# Altium schematic sheet t1-power3.SchDoc
size A3
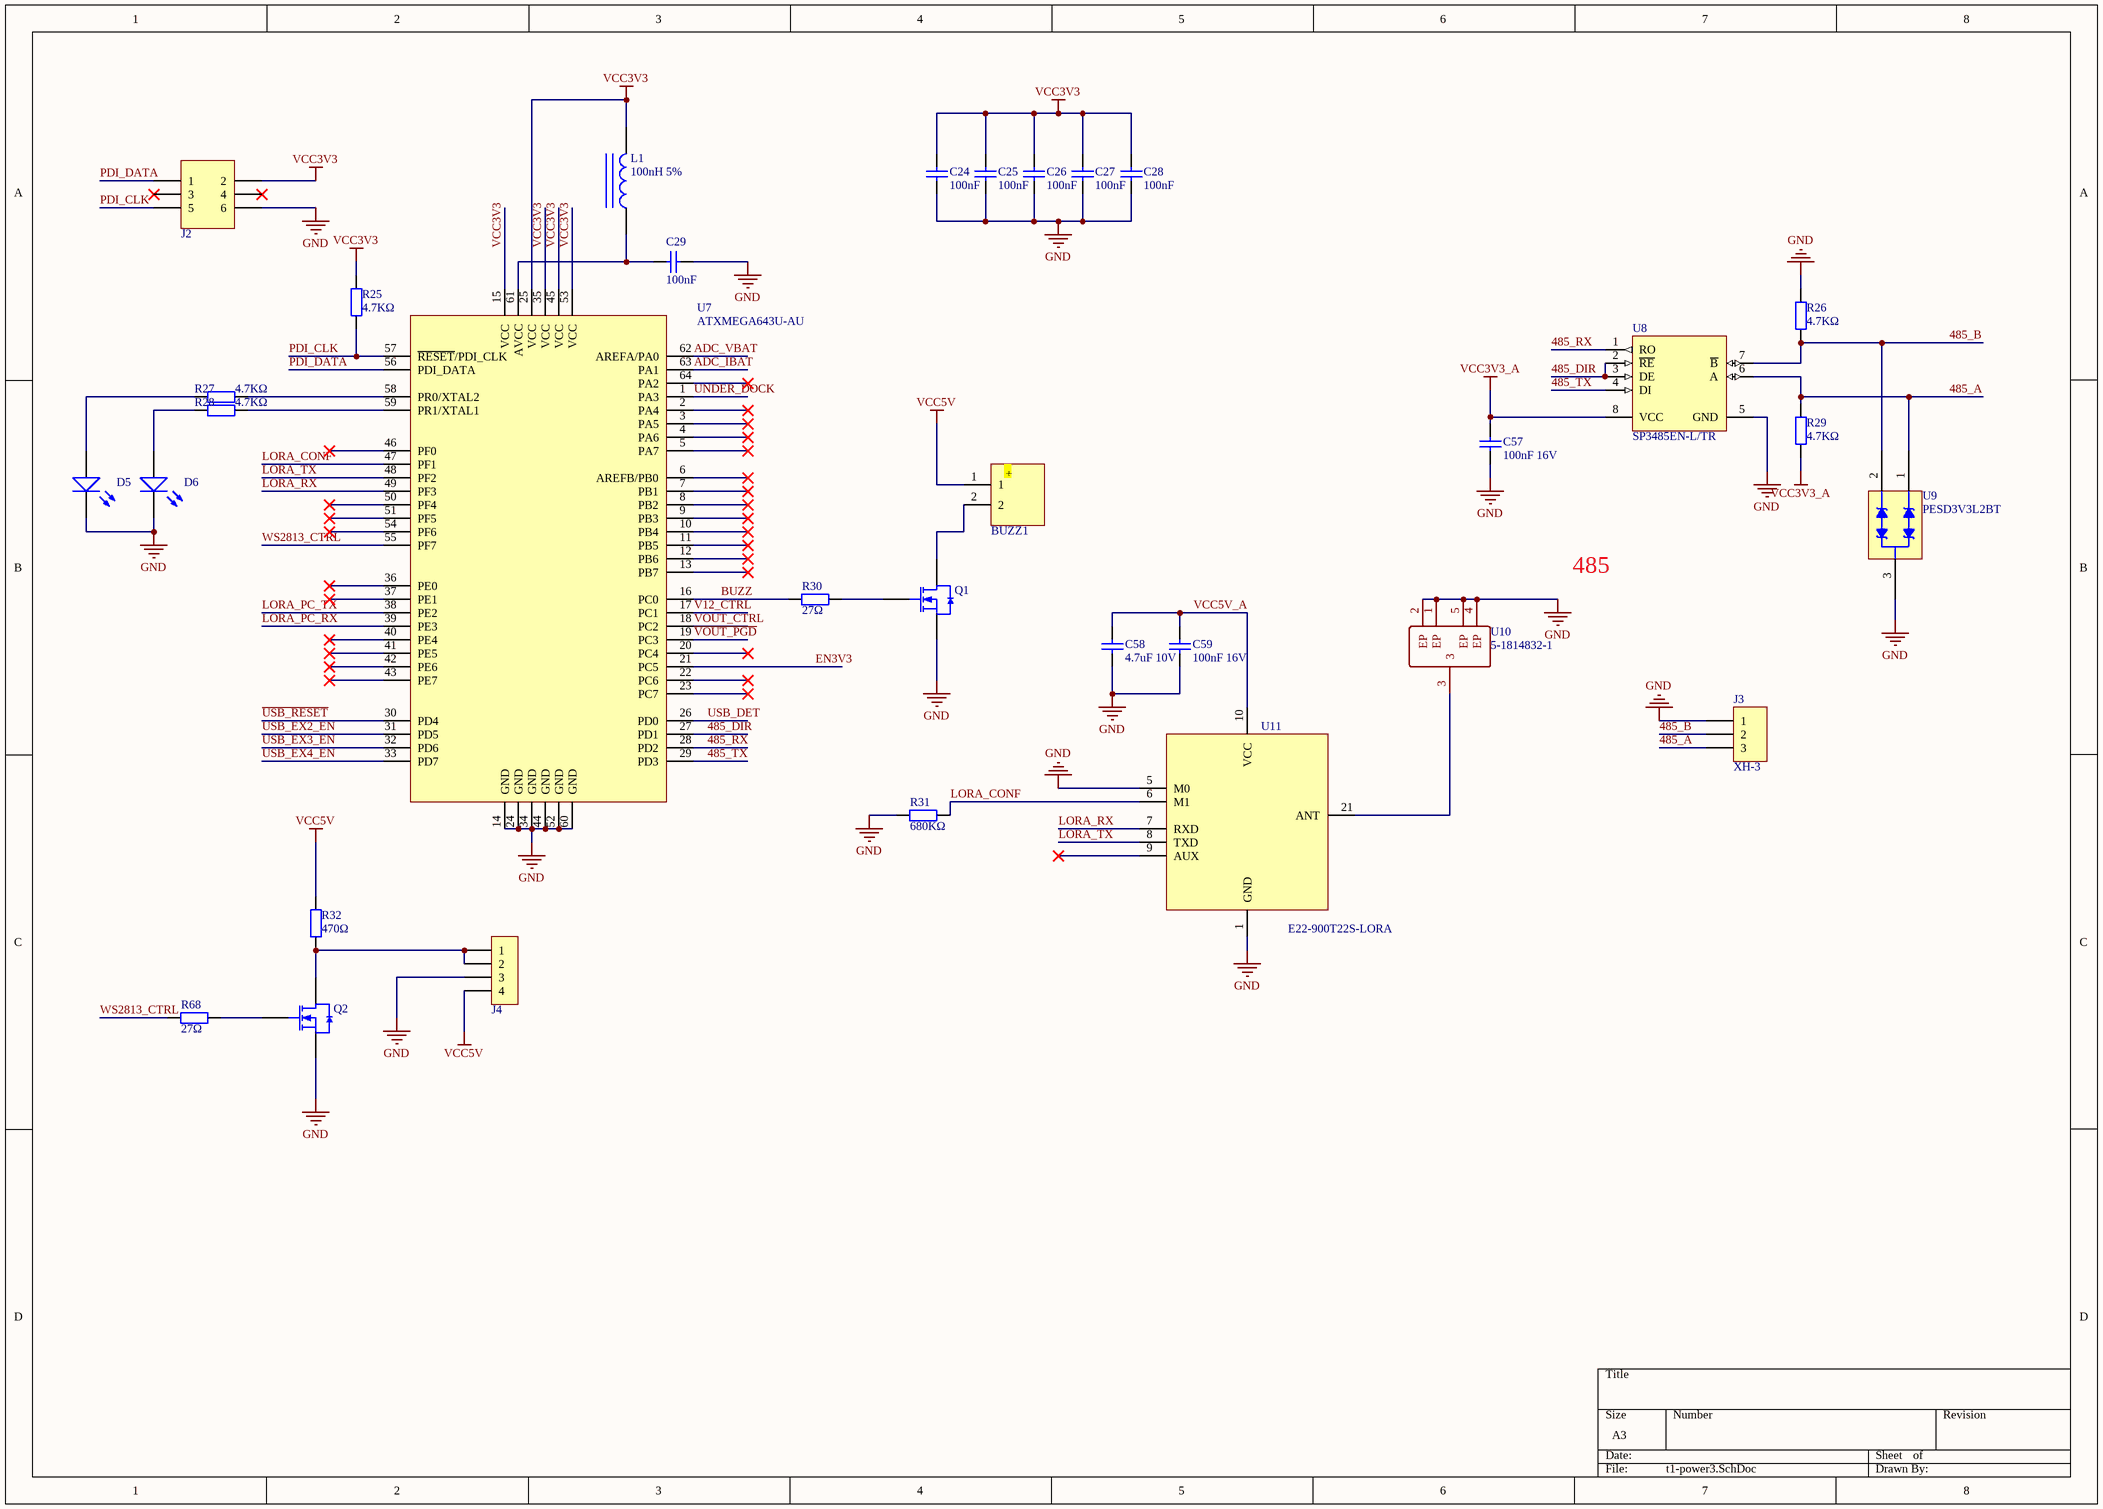
[diagram p0: t1-power3.SchDoc]

## Parts
BUZZ1  B?  [直插5.0_9*5.5mm]  (value not drawn)
C24  100nF  [0402_C]
C25  100nF  [0402_C]
C26  100nF  [0402_C]
C27  100nF  [0402_C]
C28  100nF  [0402_C]
C29  100nF  [0402_C]
C57  100nF 16V  [0402_C]
C58  4.7uF 10V  [0402_C]
C59  100nF 16V  [0402_C]
D5  白灯 0603  [0603_LED_S1]  (value not drawn)
D6  白灯 0603  [0603_LED_S1]  (value not drawn)
J2  Conn_02*03_2.54mm  [排针2.54mm]  (value not drawn)
J3  XH-3  [ph3-2.0]
J4  header4  [xh-4]  (value not drawn)
L1  100nH 5%  [0402_L]
Q1  AO3400A N道沟 X0YV1T SOT-23  [SOT-23-3L]  (value not drawn)
Q2  AO3400A N道沟 X0YV1T SOT-23  [SOT-23-3L]  (value not drawn)
R25  4.7KΩ  [0402_R]
R26  4.7KΩ  [0402_R]
R27  4.7KΩ  [0402_R]
R28  4.7KΩ  [0402_R]
R29  4.7KΩ  [0402_R]
R30  27Ω  [0402_R]
R31  680KΩ  [0402_R]
R32  470Ω  [0402_R]
R68  27Ω  [0402_R]
U7  ATXMEGA643U-AU  [TQFP-64_14*14*08P]
U8  SP3485EN-L/TR  [SOIC-8_150mil]
U9  PESD3V3L2BT  [SOT-23(SOT-23-3)]
U10  5-1814832-1  [SMA 连接器]
U11  E22-900T22S-LORA  [LORA-16mmX26mm]

## Nets
GND: C24.1 C25.1 C26.1 C27.1 C28.1 C29.2 C57.1 C58.1 C59.1 D5.K D6.K J2.6 J3.1 J4.3 Q1.2(S) Q2.2(S) R26.2 R31.1 U7.14(GND) U7.24(GND) U7.34(GND) U7.44(GND) U7.52(GND) U7.60(GND) U8.5(GND) U9.3 U10.1(EP) U10.2(EP) U10.4(EP) U10.5(EP) U11.1(GND) U11.5(M0)
VCC3V3: C24.2 C25.2 C26.2 C27.2 C28.2 J2.2 L1.2 R25.2 U7.15(VCC) U7.25(VCC) U7.35(VCC) U7.45(VCC) U7.53(VCC)
VCC3V3_A: C57.2 R29.1 U8.8(VCC)
VCC5V: BUZZ1.1 J4.4 R32.2
485_A: J3.3 R29.2 U8.6(A) U9.1
485_B: J3.2 R26.1 U8.7(~{B}) U9.2
485_DIR: U7.27(PD1) U8.2(~{RE}) U8.3(DE)
485_RX: U7.28(PD2) U8.1(RO)
485_TX: U7.29(PD3) U8.4(DI)
ADC_IBAT: U7.63(PA1)
ADC_VBAT: U7.62(AREFA/PA0)
BUZZ: R30.1 U7.16(PC0)
EN3V3: U7.21(PC5)
LORA_CONF: R31.2 U7.47(PF1) U11.6(M1)
LORA_PC_RX: U7.39(PE3)
LORA_PC_TX: U7.38(PE2)
LORA_RX: U7.49(PF3) U11.7(RXD)
LORA_TX: U7.48(PF2) U11.8(TXD)
PDI_CLK: J2.5 R25.1 U7.57(~{RESET}/PDI_CLK)
PDI_DATA: J2.1 U7.56(PDI_DATA)
~{USB_RESET}: U7.30(PD4)
UNDER_DOCK: U7.1(PA3)
USB_DET: U7.26(PD0)
USB_EX2_EN: U7.31(PD5)
USB_EX3_EN: U7.32(PD6)
USB_EX4_EN: U7.33(PD7)
V12_CTRL: U7.17(PC1)
~{VOUT_PGD}: U7.19(PC3)
VCC5V_A: C58.2 C59.2 U11.10(VCC)
VOUT_CTRL: U7.18(PC2)
WS2813_CTRL: R68.1 U7.55(PF7)
NetBUZZ1_2: BUZZ1.2 Q1.3(D)
NetC29_1: C29.1 L1.1 U7.61(AVCC)
NetD5_A: D5.A R27.1
NetD6_A: D6.A R28.1
NetJ4_1: J4.1 J4.2 Q2.3(D) R32.1
NetQ1_1: Q1.1(G) R30.2
NetQ2_1: Q2.1(G) R68.2
NetR27_2: R27.2 U7.58(PR0/XTAL2)
NetR28_2: R28.2 U7.59(PR1/XTAL1)
NetU10_3: U10.3 U11.21(ANT)

Not connected (* = marked no-connect by the designer): J2 3* 4*; U7 2(PA4)* 3(PA5)* 4(PA6)* 5(PA7)* 6(AREFB/PB0)* 7(PB1)* 8(PB2)* 9(PB3)* 10(PB4)* 11(PB5)* 12(PB6)* 13(PB7)* 20(PC4)* 22(PC6)* 23(PC7)* 36(PE0)* 37(PE1)* 40(PE4)* 41(PE5)* 42(PE6)* 43(PE7)* 46(PF0)* 50(PF4)* 51(PF5)* 54(PF6)* 64(PA2)*; U11 9(AUX)*

## Notes on the sheet
- 485
- (in symbol BUZZ) +

## Library data of the parts
BUZZ1 = BUZZ
C24-C29 C57 C59 = 0402 100nF (104) 10% 16V: 贴片电容; ComponentLink1Description: 供应商链接; ComponentLink1URL: http://www.szlcsc.com/product/details_1877.html; Package: 0402; Supplier: LC; SuppliersPartNumber: C1525
C58 = 0402 4.7uF (475) 20% 10V: 贴片电容; ComponentLink1Description: 供应商链接; ComponentLink1URL: http://www.szlcsc.com/product/details_24469.html; Package: 0402; Supplier: LC; SuppliersPartNumber: C23733
D5 D6 = 0603 白灯: 发光二极管; ComponentLink1Description: 供应商链接; ComponentLink1URL: http://www.szlcsc.com/product/details_2663.html; Package: 0603; Supplier: LC; SuppliersPartNumber: C2290
L1 = 0402 10nH 5%: 贴片电感; ComponentLink1Description: 供应商链接; ComponentLink1URL: http://www.szlcsc.com/product/details_27896.html; Package: 0402; Supplier: LC; SuppliersPartNumber: C27147
Q1 Q2 = AO3400A N道沟 X0YV1T SOT-23: MOS(场效应管); ComponentLink1Description: 供应商链接; ComponentLink1URL: http://www.szlcsc.com/product/details_21629.html; Package: SOT-23; Supplier: LC; SuppliersPartNumber: C20917
R25-R29 = 0402 4.7KΩ (4701) 1%: 贴片电阻; ComponentLink1Description: 供应商链接; ComponentLink1URL: http://www.szlcsc.com/product/details_26643.html; Package: 0402; Supplier: LC; SuppliersPartNumber: C25900
R30 R68 = 0402 27KΩ (2702) 1%: 贴片电阻; ComponentLink1Description: 供应商链接; ComponentLink1URL: http://www.szlcsc.com/product/details_26514.html; Package: 0402; Supplier: LC; SuppliersPartNumber: C25771
R31 = 0402 680Ω (6800) 1%: 贴片电阻; ComponentLink1Description: 供应商链接; ComponentLink1URL: http://www.szlcsc.com/product/details_25873.html; Package: 0402; Supplier: LC; SuppliersPartNumber: C25130
R32 = 0402 470Ω (4700) 1%: 贴片电阻; ComponentLink1Description: 供应商链接; ComponentLink1URL: http://www.szlcsc.com/product/details_25860.html; Package: 0402; Supplier: LC; SuppliersPartNumber: C25117
U7 = atxmage64a3u: TFQP-64
U8 = SP3485EN-L/TR_[C8963]: RS-485/RS-422; ComponentLink1Description: 供应商链接; ComponentLink1URL: http://www.szlcsc.com/product/details_9482.html; Package: SOIC-8; Supplier: LC; SuppliersPartNumber: C8963
U9 = PSM712-LF-T7_[C32677]: TVS; ComponentLink1Description: 供应商链接; ComponentLink1URL: http://www.szlcsc.com/product/details_33642.html; Package: SOT-23(SOT-23-3); Supplier: LC; SuppliersPartNumber: C32677